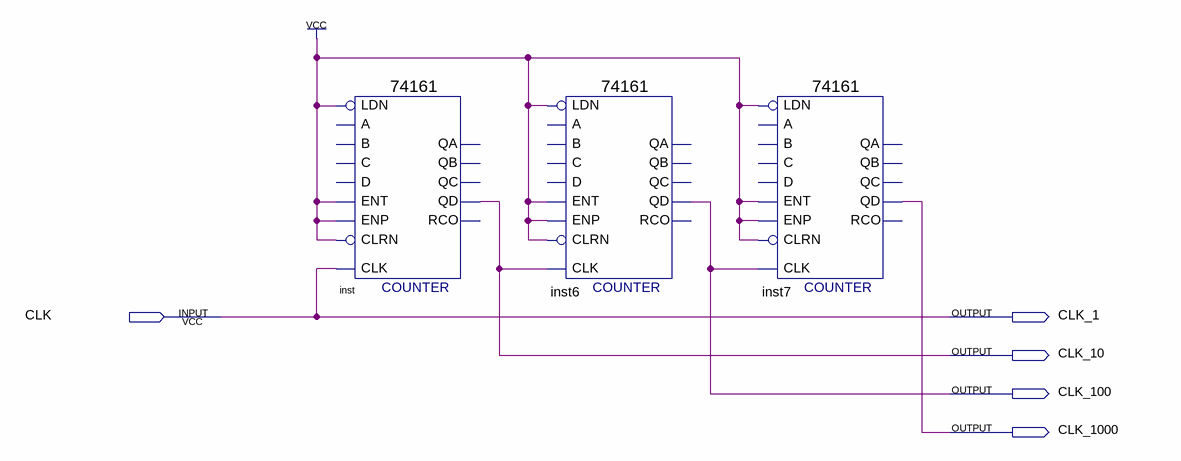
[diagram p0: schematic sheet]
// Quartus schematic fraq.bdf as structural Verilog: 3 symbols, 5 pins
module fraq (
  input  CLK,
  output CLK_1,
  output CLK_10,
  output CLK_100,
  output CLK_1000
);

  \74161  inst (
    .CLRN(1'b1), .CLK(CLK), .ENP(1'b1), .LDN(1'b1), .ENT(1'b1), .QD(CLK_10));  // open: A, D, B, C, QC, QB, QA, RCO
  \74161  inst6 (
    .CLRN(1'b1), .CLK(CLK_10), .ENP(1'b1), .LDN(1'b1), .ENT(1'b1), .QD(CLK_100));  // open: A, D, B, C, QC, QB, QA, RCO
  \74161  inst7 (
    .CLRN(1'b1), .CLK(CLK_100), .ENP(1'b1), .LDN(1'b1), .ENT(1'b1), .QD(CLK_1000));  // open: A, D, B, C, QC, QB, QA, RCO

  assign CLK_1 = CLK;
endmodule
